# Altium schematic sheet power_PCB.SchDoc
size A
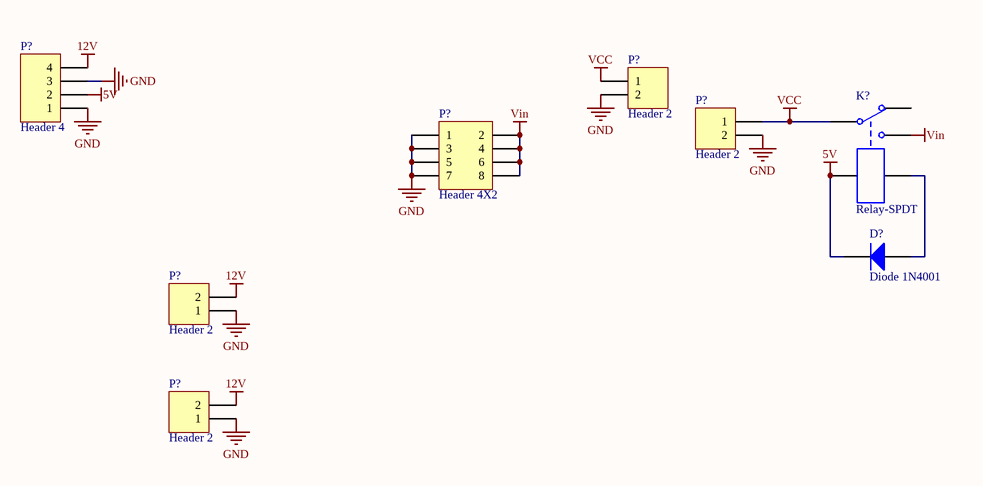
[diagram p0: power_PCB.SchDoc]

## Parts
(Parts that share a designator on the sheet are numbered #1, #2 ... from top to bottom, then left to right.)
D?  Diode 1N4001  [DO-41]
K?  Relay-SPDT  [MODULE5B]
P?#1  Header 2  [HDR1X2]
P?#2  Header 2  [HDR1X2]
P?#3  Header 4  [HDR1X4]
P?#4  Header 4X2  [HDR2X4]
P?#5  Header 2  [HDR1X2]
P?#6  Header 2  [HDR1X2]

## Nets
5V: D?.2(K) K?.4 P?#3.2
12V: P?#3.4 P?#5.2 P?#6.2
GND: P?#1.2 P?#2.2 P?#3.1 P?#3.3 P?#4.1 P?#4.3 P?#4.5 P?#4.7 P?#5.1 P?#6.1
VCC: K?.1 P?#1.1 P?#2.1
Vin: K?.3 P?#4.2 P?#4.4 P?#4.6 P?#4.8
NetD?_1: D?.1(A) K?.5

Not connected (* = marked no-connect by the designer): K? 2

## Library data of the parts
D? = Diode 1N4001: 1 Amp General Purpose Rectifier; Published: 8-Jun-2000; LatestRevisionDate: 17-Jul-2002; LatestRevisionNote: Re-released for DXP Platform.; DatasheetVersion: 1998; PackageVersion: Aug-1999; PackageReference: DO-41; Publisher: Altium Limited; PackageDescription: Diode, Axial; Body 5.2 x 2.7 mm (LxDia. max), Lead Dia. 0.86 mm (max); Code_JEDEC: DO-204-AL; ComponentLink1Description: Manufacturer Link; ComponentLink1URL: http://www.fairchildsemi.com/; ComponentLink2Description: Datasheet; ComponentLink2URL: http://www.fairchildsemi.com/ds/1N%2F1N4001.pdf
K? = Relay-SPDT: Single-Pole Dual-Throw Relay; Published: 24-Mar-1999; LatestRevisionDate: 17-Jul-2002; LatestRevisionNote: Re-released for DXP Platform.; PackageReference: MODULE5B; Publisher: Altium Limited
P?#1 P?#2 P?#5 P?#6 = Header 2: Header, 2-Pin; LatestRevisionDate: 17-Jul-2002; LatestRevisionNote: Re-released for DXP Platform.; Publisher: Altium Limited
P?#3 = Header 4: Header, 4-Pin; LatestRevisionDate: 17-Jul-2002; LatestRevisionNote: Re-released for DXP Platform.; Publisher: Altium Limited
P?#4 = Header 4X2: Header, 4-Pin, Dual row; LatestRevisionDate: 17-Jul-2002; LatestRevisionNote: Re-released for DXP Platform.; Publisher: Altium Limited